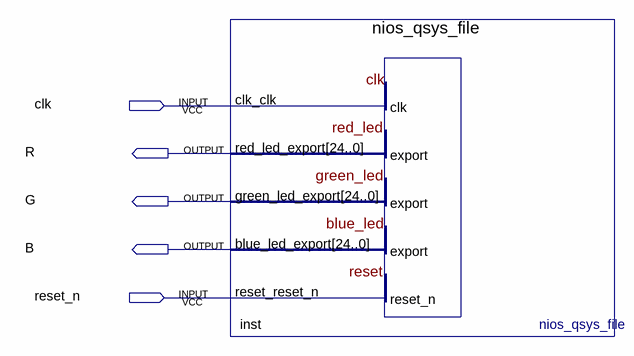
[diagram p0: schematic sheet]
// Quartus schematic nios_leds_connected.bdf as structural Verilog: 1 symbols, 5 pins
module nios_leds_connected (
  input  clk,
  input  reset_n,
  output R,
  output G,
  output B
);

  nios_qsys_file inst (
    .clk_clk(clk), .reset_reset_n(reset_n), .red_led_export(R), .green_led_export(G), .blue_led_export(B));
endmodule
